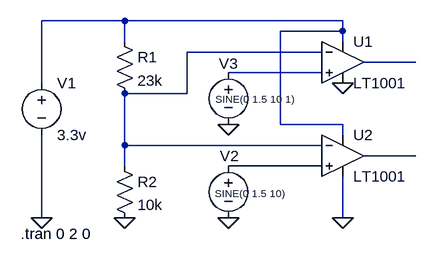
[diagram p0: schematic DualComparatorOverCurrent.asc]
DualComparatorOverCurrent.asc, the LTspice schematic file:
Version 4
SHEET 1 880 680
WIRE 96 16 -32 16
WIRE 432 16 96 16
WIRE 432 32 432 16
WIRE 432 32 336 32
WIRE 96 48 96 16
WIRE 432 48 432 32
WIRE 400 64 192 64
WIRE 544 80 464 80
WIRE 400 96 256 96
WIRE -32 112 -32 16
WIRE 192 128 192 64
WIRE 192 128 96 128
WIRE 336 176 336 32
WIRE 432 176 336 176
WIRE 432 192 432 176
WIRE 96 208 96 128
WIRE 400 208 96 208
WIRE 544 224 464 224
WIRE 96 240 96 208
WIRE 400 240 256 240
WIRE -32 320 -32 192
WIRE 432 320 432 256
FLAG -32 320 0
FLAG 96 320 0
FLAG 256 176 0
FLAG 256 320 0
FLAG 432 112 0
FLAG 432 320 0
SYMBOL voltage -32 96 R0
WINDOW 123 0 0 Left 0
WINDOW 39 0 0 Left 0
SYMATTR InstName V1
SYMATTR Value 3.3v
SYMBOL res 80 32 R0
SYMATTR InstName R1
SYMATTR Value 23k
SYMBOL res 80 224 R0
SYMATTR InstName R2
SYMATTR Value 10k
SYMBOL voltage 256 224 R0
WINDOW 0 -13 0 Left 2
WINDOW 3 -21 58 Left 1
WINDOW 123 0 0 Left 0
WINDOW 39 0 0 Left 0
SYMATTR InstName V2
SYMATTR Value SINE(0 1.5 10)
SYMBOL voltage 256 80 R0
WINDOW 0 -15 2 Left 2
WINDOW 3 -20 57 Left 1
WINDOW 123 0 0 Left 0
WINDOW 39 0 0 Left 0
SYMATTR InstName V3
SYMATTR Value SINE(0 1.5 10 1)
SYMBOL OpAmps\\LT1001 432 16 R0
SYMATTR InstName U1
SYMBOL OpAmps\\LT1001 432 160 R0
SYMATTR InstName U2
TEXT -64 344 Left 2 !.tran 0 2 0

The netlist it stands for:
* DualComparatorOverCurrent.asc
V1 N001 0 3.3v
R1 N001 N002 23k
R2 N002 0 10k
V2 N006 0 SINE(0 1.5 10)
V3 N004 0 SINE(0 1.5 10 1)
XU1 N004 N002 N001 0 N003 LT1001  ; pins In+ In- V+ V- OUT
XU2 N006 N002 N001 0 N005 LT1001  ; pins In+ In- V+ V- OUT
.tran 0 2 0
.lib LTC.lib
.backanno
.end